# EAGLE design Spannungsversorgung (EAGLE 4.15)
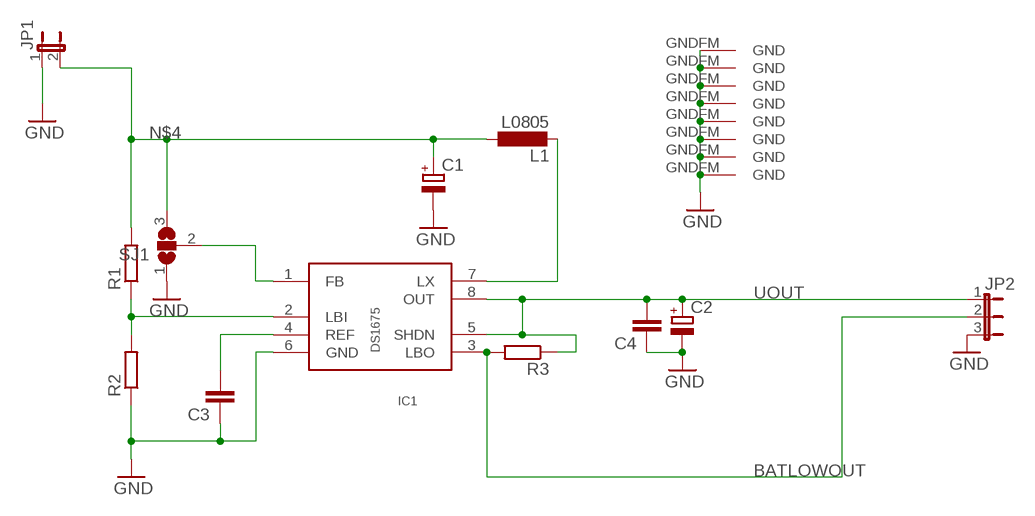
[diagram p0: schematic, sheet 1]

## Parts
C1  CPOL-EUSMCD  [SMC_D]
C2  CPOL-EUSMCD  [SMC_D]
C3  C-EUC0805  [C0805]
C4  C-EUC0805  [C0805]
IC1  DS1675  [UMAX08]
JP1  JP1E  [JP1]
JP2  JP2E  [JP2]
L1  L0805  [C0805]
R1  R-EU_M0805  [M0805]
R2  R-EU_M0805  [M0805]
R3  R-EU_M0805  [M0805]
SJ1  SJ2W  [SJ_2]
U$1  STITCHVIA  [STITCHVIA]
U$2  STITCHVIA  [STITCHVIA]
U$3  STITCHVIA  [STITCHVIA]
U$4  STITCHVIA  [STITCHVIA]
U$5  STITCHVIA  [STITCHVIA]
U$6  STITCHVIA  [STITCHVIA]
U$7  STITCHVIA  [STITCHVIA]
U$8  STITCHVIA  [STITCHVIA]

## Nets
BATLOWOUT: IC1.3(LBO) JP2.2 R3.2
GND: C1.- C2.- C3.1 C4.1 IC1.6(GND) JP1.1 JP2.3 R2.1 SJ1.1 U$1.GNDFM(GND) U$2.GNDFM(GND) U$3.GNDFM(GND) U$4.GNDFM(GND) U$5.GNDFM(GND) U$6.GNDFM(GND) U$7.GNDFM(GND) U$8.GNDFM(GND)
N$1: IC1.7(LX) L1.2
N$2: IC1.2(LBI) R1.1 R2.2
N$3: C3.2 IC1.4(REF)
N$4: C1.+ JP1.2 L1.1 R1.2 SJ1.3
N$5: IC1.1(FB) SJ1.2
UOUT: C2.+ C4.2 IC1.5(SHDN) IC1.8(OUT) JP2.1 R3.1

## Library data of the parts
C1 C2 = rcl:CPOL-EU: POLARIZED CAPACITOR, European symbol
C3 C4 = rcl:C-EU: CAPACITOR, European symbol
IC1 = turbod3:DS1675
JP1 = jumper:JP1E: JUMPER
JP2 = jumper:JP2E: JUMPER
L1 = turbod3:L
R1-R3 = rcl:R-EU_: RESISTOR, European symbol
SJ1 = jumper:SJ2W: SMD solder JUMPER
U$1-U$8 = turbod3:STITCHVIA

## Board
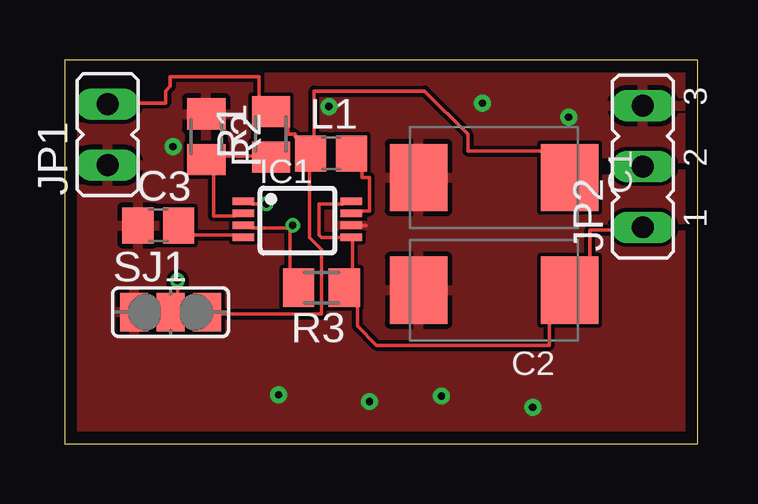
[diagram p1: board, top side]
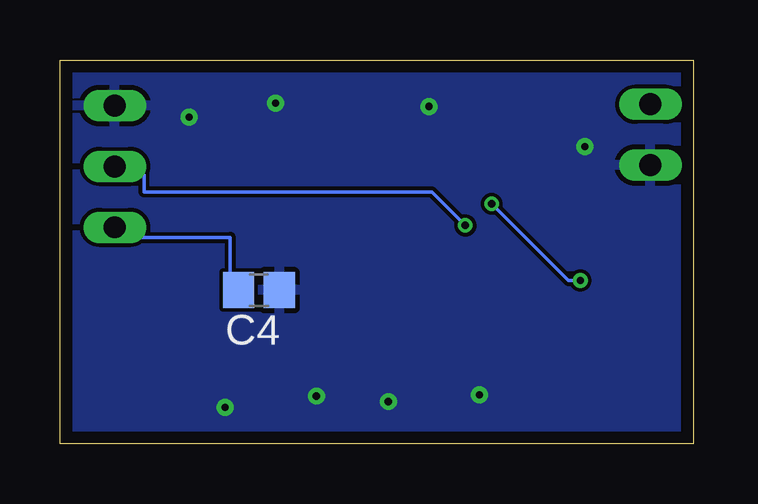
[diagram p2: board, bottom side, seen from below]

Size 26.4 x 16 mm. Coordinates in mm from the lower left corner, seen from the top.
Outline: 0,0 26.4,0 26.4,16 0,16 0,0
Copper layers (1*16): Top 0.035mm / dielectric 1.5mm / Bottom 0.035mm
Design rules "PCB-POOL": minimum track width 6mil, minimum drill 12mil, track to track 6mil, track to pad 6mil, pad to pad 6mil, via to via 6mil, smd to smd 6mil, copper to edge 20mil, drill to drill 8mil, minimum pad ring 8mil, minimum via ring 6mil, stop-mask expansion 3mil, vias tented up to drill 0mil, thermal gap 8mil

### Footprints (pad centres in the part's own frame; a part is rotated, then mirrored left to right if it is on the bottom)
SMC_D = smd 2.4 x 2.8: + -3.15,0; - 3.15,0
C0805 = smd 1.3 x 1.5: 1 -0.85,0; 2 0.85,0
UMAX08 = smd 0.32 x 0.9: 1 -1,-2.25; 2 -0.5,-2.25; 3 0,-2.25; 4 0.5,-2.25; 5 0.5,2.25; 6 0,2.25; 7 -0.5,2.25; 8 -1,2.25
JP1 = drill 0.914 long: 1 0,-1.27; 2 0,1.27
JP2 = drill 0.914 long: 1 -2.54,0; 2 0,0; 3 2.54,0
M0805 = smd 1.3 x 1.6: 1 -0.95,0; 2 0.95,0
SJ_2 = smd 1.168 x 1.6: 1 -1.524,0; 2 0,0; 3 1.524,0
STITCHVIA = drill 0.3 pad 0.6 round: GNDFM 0,0

### Placement (x,y rotation side)
C1  17.9,11.1 180 top
C2  17.9,6.4 180 top
C3  3.9,9.1 0 top
C4  18.1,6.4 180 bottom
IC1  9.7,9.1 270 top
JP1  1.78,12.88 0 top
JP2  24.11,11.56 90 top
L1  11.1,12.1 0 top
R1  8.6,12.9 90 top
R2  5.9,12.8 270 top
R3  10.7,6.5 180 top
SJ1  4.41,5.48 0 top
U$1  19.51,1.51 0 top
U$2  15.71,1.98 0 top
U$3  12.71,1.75 0 top
U$4  21.01,13.62 0 top
U$5  4.51,12.39 0 top
U$6  11.01,14.06 0 top
U$7  8.91,2.03 0 top
U$8  17.41,14.2 0 top

### Tracks (layer width: path | path; a pad name or v marks a point on that pad's centre or on a via)
BATLOWOUT  (via drill 0.3)
  Top 0.152: 9.4,9 7.8,9 IC1.3 | 9.4,9 9.4,7.2 R3.2 | 9.4,9 v9.5,9.1
  Bottom 0.152: v9.5,9.1 10.9,10.5 22.9,10.5 22.9,11.2 JP2.2
GND
  Top 0.152: IC1.6 12.4,9.1 12.56,9.1
  pour Top: 0.2,15.8 26.1,15.8 26.1,0.2 0.2,0.2
  pour Bottom: 0.2,15.8 26.1,15.8 26.1,0.2 0.2,0.2
N$1
  Top 0.152: IC1.7 12.3,9.7 12.7,9.7 12.7,11.1 12.4,11.1 12.4,11.4 L1.2
N$2
  Top 0.152: IC1.2 7.1,9.5 6.2,9.5 6.2,11.3 R2.2 6.6,12 7.9,12 R1.1
N$3
  Top 0.152: IC1.4 7.1,8.7 5.3,8.7 C3.2
N$4
  Top 0.152: L1.1 9.7,12.8 9.6,12.8 9.6,12.9 9.3,12.9 9.3,13.3 R1.2 8.1,14.4 8.1,15.3 4.4,15.3 4.4,14.9 4.2,14.7 4.2,14.2 3.1,14.2 JP1.2 | SJ1.3 6.5,5.4 10.7,5.4 10.7,8.1 10.2,8.6 10.2,11.4 L1.1 | C1.+ 19.9,12.2 16.8,12.2 16.8,12.9 15,14.7 10.4,14.7 10.4,12.8 L1.1
N$5  (via drill 0.3)
  Top 0.152: v8.4,10 7.8,10 IC1.1 | v4.7,6.8 4.7,6.2 SJ1.2
  Bottom 0.152: v8.4,10 5.2,6.8 v4.7,6.8
UOUT
  Top 0.152: IC1.8 11.6,10 10.6,10 10.6,8.7 10.7,8.6 IC1.5 12,8.5 12,7.2 R3.1 12.2,5.8 12.2,4.9 13,4.1 20.2,4.1 20.2,5.1 C2.+ 21.9,7.7 21.9,8.9 22.8,8.9 JP2.1
  Bottom 0.152: C4.2 19.3,7.1 19.3,8.6 23,8.6 JP2.1